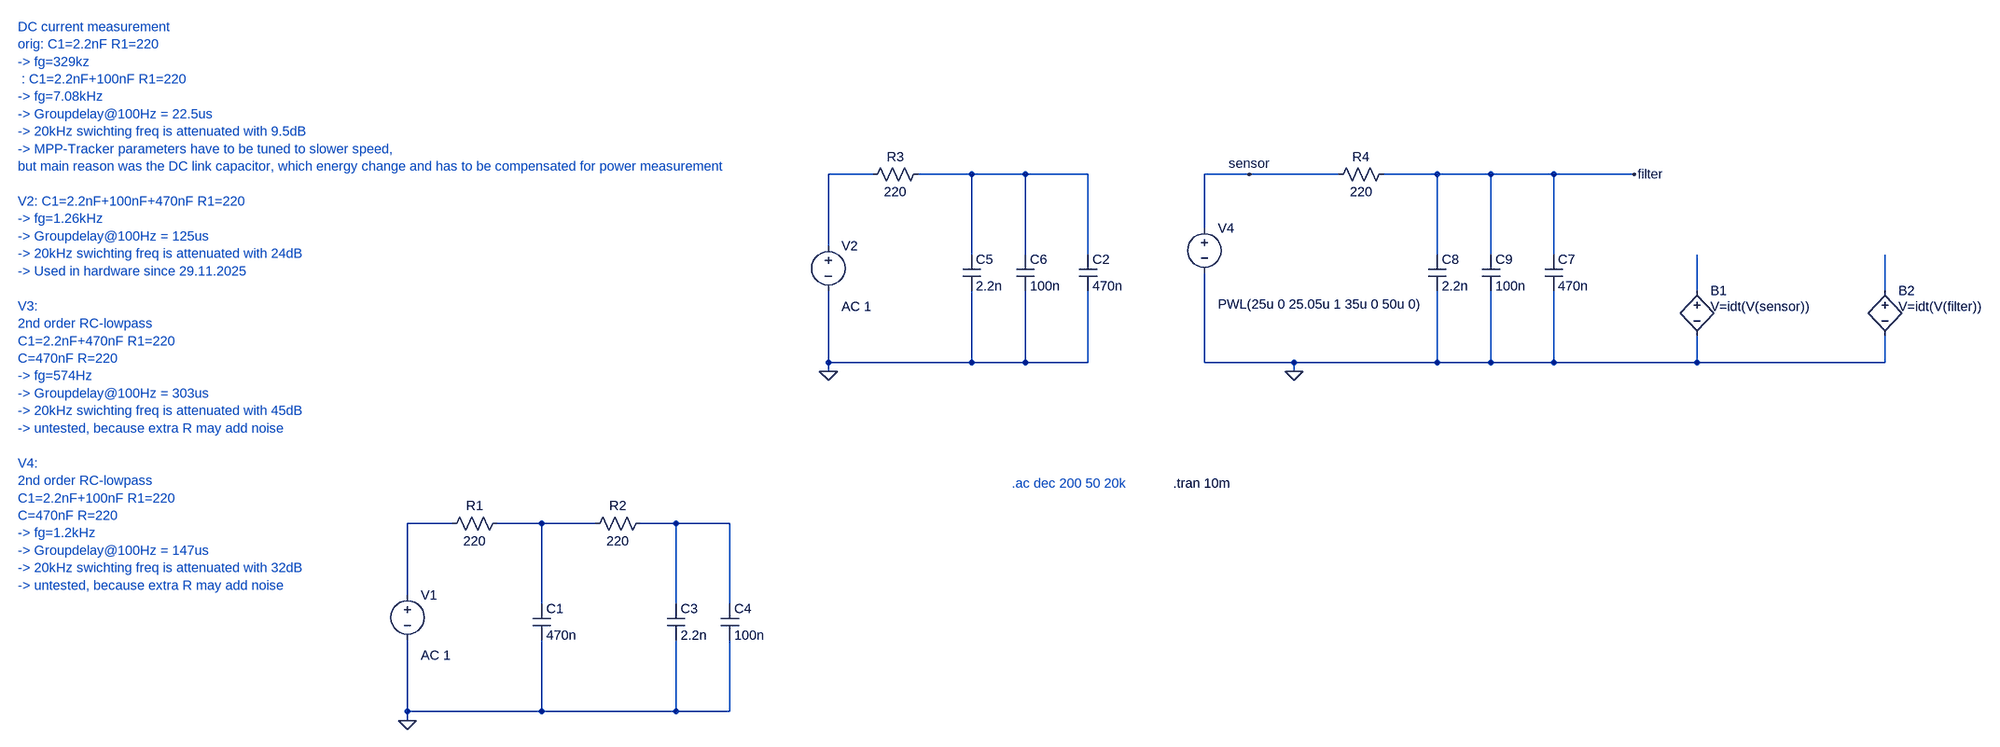
[diagram p0: schematic RC-lowpass_DC_current.asc]
RC-lowpass_DC_current.asc, the LTspice schematic file:
Version 4
SHEET 1 3404 680
WIRE 1344 -624 1264 -624
WIRE 1520 -624 1424 -624
WIRE 1616 -624 1520 -624
WIRE 1728 -624 1616 -624
WIRE 2016 -624 1936 -624
WIRE 2176 -624 2016 -624
WIRE 2352 -624 2256 -624
WIRE 2448 -624 2352 -624
WIRE 2560 -624 2448 -624
WIRE 2704 -624 2560 -624
WIRE 1936 -528 1936 -624
WIRE 1264 -496 1264 -624
WIRE 1520 -480 1520 -624
WIRE 1616 -480 1616 -624
WIRE 1728 -480 1728 -624
WIRE 2352 -480 2352 -624
WIRE 2448 -480 2448 -624
WIRE 2560 -480 2560 -624
WIRE 2816 -416 2816 -480
WIRE 3152 -416 3152 -480
WIRE 1264 -288 1264 -416
WIRE 1520 -288 1520 -416
WIRE 1520 -288 1264 -288
WIRE 1616 -288 1616 -416
WIRE 1616 -288 1520 -288
WIRE 1728 -288 1728 -416
WIRE 1728 -288 1616 -288
WIRE 1936 -288 1936 -448
WIRE 2096 -288 1936 -288
WIRE 2352 -288 2352 -416
WIRE 2352 -288 2096 -288
WIRE 2448 -288 2448 -416
WIRE 2448 -288 2352 -288
WIRE 2560 -288 2560 -416
WIRE 2560 -288 2448 -288
WIRE 2816 -288 2816 -336
WIRE 2816 -288 2560 -288
WIRE 3152 -288 3152 -336
WIRE 3152 -288 2816 -288
WIRE 1264 -272 1264 -288
WIRE 2096 -272 2096 -288
WIRE 592 0 512 0
WIRE 752 0 672 0
WIRE 848 0 752 0
WIRE 992 0 928 0
WIRE 1088 0 992 0
WIRE 512 128 512 0
WIRE 752 144 752 0
WIRE 992 144 992 0
WIRE 1088 144 1088 0
WIRE 512 336 512 208
WIRE 752 336 752 208
WIRE 752 336 512 336
WIRE 992 336 992 208
WIRE 992 336 752 336
WIRE 1088 336 1088 208
WIRE 1088 336 992 336
WIRE 512 352 512 336
FLAG 512 352 0
FLAG 1264 -272 0
FLAG 2096 -272 0
FLAG 2016 -624 sensor
FLAG 2704 -624 filter
SYMBOL res 688 -16 R90
WINDOW 0 0 56 VBottom 2
WINDOW 3 32 56 VTop 2
SYMATTR InstName R1
SYMATTR Value 220
SYMBOL voltage 512 112 R0
WINDOW 123 24 124 Left 2
WINDOW 39 0 0 Left 0
SYMATTR Value2 AC 1
SYMATTR InstName V1
SYMATTR Value ""
SYMBOL cap 736 144 R0
SYMATTR InstName C1
SYMATTR Value 470n
SYMBOL cap 976 144 R0
SYMATTR InstName C3
SYMATTR Value 2.2n
SYMBOL cap 1072 144 R0
SYMATTR InstName C4
SYMATTR Value 100n
SYMBOL res 944 -16 R90
WINDOW 0 0 56 VBottom 2
WINDOW 3 32 56 VTop 2
SYMATTR InstName R2
SYMATTR Value 220
SYMBOL res 1440 -640 R90
WINDOW 0 0 56 VBottom 2
WINDOW 3 32 56 VTop 2
SYMATTR InstName R3
SYMATTR Value 220
SYMBOL voltage 1264 -512 R0
WINDOW 123 24 124 Left 2
WINDOW 39 0 0 Left 0
SYMATTR Value2 AC 1
SYMATTR InstName V2
SYMATTR Value ""
SYMBOL cap 1712 -480 R0
SYMATTR InstName C2
SYMATTR Value 470n
SYMBOL cap 1504 -480 R0
SYMATTR InstName C5
SYMATTR Value 2.2n
SYMBOL cap 1600 -480 R0
SYMATTR InstName C6
SYMATTR Value 100n
SYMBOL res 2272 -640 R90
WINDOW 0 0 56 VBottom 2
WINDOW 3 32 56 VTop 2
SYMATTR InstName R4
SYMATTR Value 220
SYMBOL cap 2544 -480 R0
SYMATTR InstName C7
SYMATTR Value 470n
SYMBOL cap 2336 -480 R0
SYMATTR InstName C8
SYMATTR Value 2.2n
SYMBOL cap 2432 -480 R0
SYMATTR InstName C9
SYMATTR Value 100n
SYMBOL voltage 1936 -544 R0
WINDOW 123 24 124 Left 2
WINDOW 39 0 0 Left 0
WINDOW 3 24 152 Left 2
SYMATTR Value PWL(25u 0 25.05u 1 35u 0 50u 0)
SYMATTR InstName V4
SYMBOL bv 2816 -432 R0
WINDOW 3 24 44 Left 2
SYMATTR Value V=idt(V(sensor))
SYMATTR InstName B1
SYMBOL bv 3152 -432 R0
WINDOW 3 24 44 Left 2
SYMATTR Value V=idt(V(filter))
SYMATTR InstName B2
TEXT 1592 -72 Left 2 ;.ac dec 200 50 20k
TEXT -184 -888 Left 2 ;DC current measurement\norig: C1=2.2nF R1=220\n-> fg=329kz\n : C1=2.2nF+100nF R1=220\n-> fg=7.08kHz\n-> Groupdelay@100Hz = 22.5us\n-> 20kHz swichting freq is attenuated with 9.5dB\n-> MPP-Tracker parameters have to be tuned to slower speed,\nbut main reason was the DC link capacitor, which energy change and has to be compensated for power measurement\n \nV2: C1=2.2nF+100nF+470nF R1=220\n-> fg=1.26kHz\n-> Groupdelay@100Hz = 125us\n-> 20kHz swichting freq is attenuated with 24dB\n-> Used in hardware since 29.11.2025\n \nV3:\n2nd order RC-lowpass\nC1=2.2nF+470nF R1=220\nC=470nF R=220\n-> fg=574Hz\n-> Groupdelay@100Hz = 303us\n-> 20kHz swichting freq is attenuated with 45dB\n-> untested, because extra R may add noise\n \nV4:\n2nd order RC-lowpass\nC1=2.2nF+100nF R1=220\nC=470nF R=220\n-> fg=1.2kHz\n-> Groupdelay@100Hz = 147us\n-> 20kHz swichting freq is attenuated with 32dB\n-> untested, because extra R may add noise
TEXT 1880 -72 Left 2 !.tran 10m

The netlist it stands for:
* RC-lowpass_DC_current.asc
R1 N006 N005 220
V1 N005 0 AC 1
C1 N006 0 470n
C3 N007 0 2.2n
C4 N007 0 100n
R2 N007 N006 220
R3 N002 N001 220
V2 N001 0 AC 1
C2 N002 0 470n
C5 N002 0 2.2n
C6 N002 0 100n
R4 filter sensor 220
C7 filter 0 470n
C8 filter 0 2.2n
C9 filter 0 100n
V4 sensor 0 PWL(25u 0 25.05u 1 35u 0 50u 0)
B1 N003 0 V=idt(V(sensor))
B2 N004 0 V=idt(V(filter))
* .ac dec 200 50 20k
* DC current measurement
* orig: C1=2.2nF R1=220
* -> fg=329kz
*  : C1=2.2nF+100nF R1=220
* -> fg=7.08kHz
* -> Groupdelay@100Hz = 22.5us
* -> 20kHz swichting freq is attenuated with 9.5dB
* -> MPP-Tracker parameters have to be tuned to slower speed,
* but main reason was the DC link capacitor, which energy change and has to be compensated for power measurement
* V2: C1=2.2nF+100nF+470nF R1=220
* -> fg=1.26kHz
* -> Groupdelay@100Hz = 125us
* -> 20kHz swichting freq is attenuated with 24dB
* -> Used in hardware since 29.11.2025
* V3:
* 2nd order RC-lowpass
* C1=2.2nF+470nF R1=220
* C=470nF R=220
* -> fg=574Hz
* -> Groupdelay@100Hz = 303us
* -> 20kHz swichting freq is attenuated with 45dB
* -> untested, because extra R may add noise
* V4:
* 2nd order RC-lowpass
* C1=2.2nF+100nF R1=220
* C=470nF R=220
* -> fg=1.2kHz
* -> Groupdelay@100Hz = 147us
* -> 20kHz swichting freq is attenuated with 32dB
* -> untested, because extra R may add noise
.tran 10m
.backanno
.end